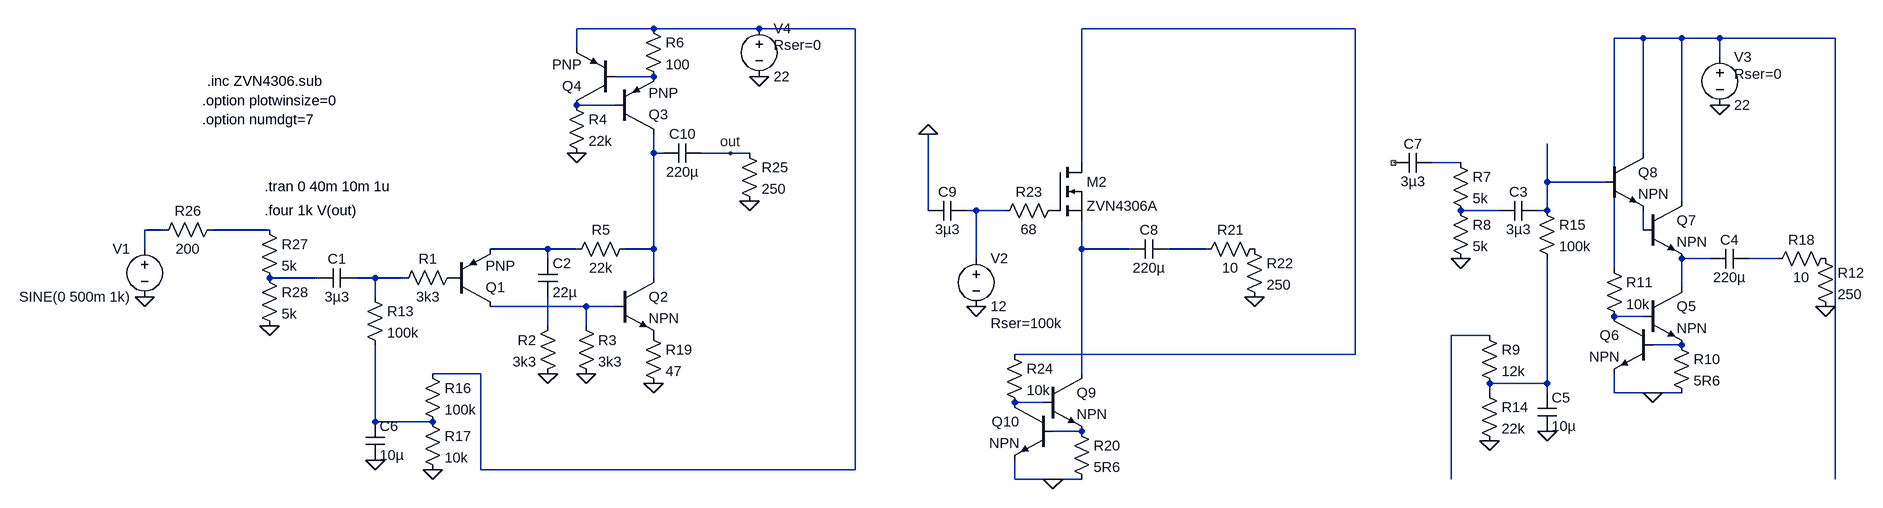
[diagram p0: schematic new_amplifier.asc]
new_amplifier.asc, the LTspice schematic file:
Version 4
SHEET 1 3012 680
WIRE 464 -336 336 -336
WIRE 640 -336 464 -336
WIRE 800 -336 640 -336
WIRE 2160 -336 1616 -336
WIRE 2640 -320 2592 -320
WIRE 2704 -320 2640 -320
WIRE 2768 -320 2704 -320
WIRE 2960 -320 2768 -320
WIRE 336 -304 336 -336
WIRE 2768 -288 2768 -320
WIRE 464 -256 400 -256
WIRE 400 -208 336 -208
WIRE 464 -128 464 -160
WIRE 480 -128 464 -128
WIRE 592 -128 544 -128
WIRE 624 -128 592 -128
WIRE 2640 -128 2640 -320
WIRE 1616 -112 1616 -336
WIRE 2336 -112 2288 -112
WIRE 2480 -80 2480 -144
WIRE 2576 -80 2480 -80
WIRE 2704 -48 2704 -320
WIRE 1360 -32 1360 -160
WIRE 1440 -32 1424 -32
WIRE 1488 -32 1440 -32
WIRE 2400 -32 2336 -32
WIRE 2480 -32 2480 -80
WIRE 2480 -32 2464 -32
WIRE -352 0 -384 0
WIRE -176 0 -272 0
WIRE 2640 0 2640 -32
WIRE -384 32 -384 0
WIRE 288 32 192 32
WIRE 336 32 288 32
WIRE 464 32 464 -128
WIRE 464 32 416 32
WIRE 1616 32 1616 -16
WIRE 1696 32 1616 32
WIRE 1824 32 1760 32
WIRE 288 48 288 32
WIRE 1440 48 1440 -32
WIRE 2752 48 2704 48
WIRE 2864 48 2816 48
WIRE 2592 64 2592 -320
WIRE -96 80 -176 80
WIRE 0 80 -32 80
WIRE 48 80 0 80
WIRE 464 80 464 32
WIRE 2704 96 2704 48
WIRE 0 112 0 80
WIRE 352 128 192 128
WIRE 400 128 352 128
WIRE 2640 144 2592 144
WIRE 288 160 288 112
WIRE 352 160 352 128
WIRE 2384 176 2320 176
WIRE 2704 192 2656 192
WIRE 2160 208 2160 -336
WIRE 2160 208 1504 208
WIRE 176 240 96 240
WIRE 1616 240 1616 32
WIRE 2480 256 2480 48
WIRE 2480 256 2384 256
WIRE 2384 272 2384 256
WIRE 2480 272 2480 256
WIRE 2592 272 2592 240
WIRE 2656 272 2592 272
WIRE 2704 272 2656 272
WIRE 1552 288 1504 288
WIRE 0 320 0 192
WIRE 96 320 0 320
WIRE 1616 336 1568 336
WIRE 176 400 176 240
WIRE 800 400 800 -336
WIRE 800 400 176 400
WIRE 1504 416 1504 384
WIRE 1568 416 1504 416
WIRE 1616 416 1568 416
WIRE 2320 416 2320 176
WIRE 2960 416 2960 -320
FLAG -384 112 0
FLAG 288 240 0
FLAG 352 240 0
FLAG 336 -128 0
FLAG 2336 48 0
FLAG 2656 272 0
FLAG 2768 -208 0
FLAG 2384 352 0
FLAG 0 384 0
FLAG 96 400 0
FLAG 2944 128 0
FLAG 2480 336 0
FLAG 464 256 0
FLAG 1904 112 0
FLAG 1440 128 0
FLAG 1568 416 0
FLAG 1360 -160 0
FLAG 624 -48 0
FLAG 592 -128 out
FLAG -176 160 0
FLAG 640 -256 0
SYMBOL voltage -384 16 M0
WINDOW 123 0 0 Left 0
WINDOW 39 0 0 Left 0
SYMATTR InstName V1
SYMATTR Value SINE(0 500m 1k)
SYMBOL cap -32 64 R90
WINDOW 0 0 32 VBottom 2
WINDOW 3 32 32 VTop 2
SYMATTR InstName C1
SYMATTR Value 3µ3
SYMBOL res 144 64 R90
WINDOW 0 0 56 VBottom 2
WINDOW 3 32 56 VTop 2
SYMATTR InstName R1
SYMATTR Value 3k3
SYMBOL pnp 128 128 M180
SYMATTR InstName Q1
SYMBOL cap 272 48 R0
SYMATTR InstName C2
SYMATTR Value 22µ
SYMBOL res 304 144 M0
SYMATTR InstName R2
SYMATTR Value 3k3
SYMBOL res 336 144 R0
SYMATTR InstName R3
SYMATTR Value 3k3
SYMBOL npn 400 80 R0
SYMATTR InstName Q2
SYMBOL pnp 400 -160 M180
SYMATTR InstName Q3
SYMBOL pnp 400 -208 R180
SYMATTR InstName Q4
SYMBOL res 320 -224 R0
SYMATTR InstName R4
SYMATTR Value 22k
SYMBOL res 432 16 R90
WINDOW 0 0 56 VBottom 2
WINDOW 3 32 56 VTop 2
SYMATTR InstName R5
SYMATTR Value 22k
SYMBOL res 448 -352 R0
SYMATTR InstName R6
SYMATTR Value 100
SYMBOL res 2320 -128 R0
SYMATTR InstName R7
SYMATTR Value 5k
SYMBOL res 2320 -48 R0
SYMATTR InstName R8
SYMATTR Value 5k
SYMBOL cap 2464 -48 R90
WINDOW 0 0 32 VBottom 2
WINDOW 3 32 32 VTop 2
SYMATTR InstName C3
SYMATTR Value 3µ3
SYMBOL npn 2640 96 R0
SYMATTR InstName Q5
SYMBOL npn 2656 144 M0
SYMATTR InstName Q6
SYMBOL res 2688 176 R0
SYMATTR InstName R10
SYMATTR Value 5R6
SYMBOL res 2576 48 R0
SYMATTR InstName R11
SYMATTR Value 10k
SYMBOL cap 2816 32 R90
WINDOW 0 0 32 VBottom 2
WINDOW 3 32 32 VTop 2
SYMATTR InstName C4
SYMATTR Value 220µ
SYMBOL res 2928 32 R0
SYMATTR InstName R12
SYMATTR Value 250
SYMBOL voltage 2768 -304 R0
WINDOW 123 0 0 Left 0
WINDOW 39 24 44 Left 2
SYMATTR SpiceLine Rser=0
SYMATTR InstName V3
SYMATTR Value 22
SYMBOL res -16 96 R0
SYMATTR InstName R13
SYMATTR Value 100k
SYMBOL res 2368 160 R0
SYMATTR InstName R9
SYMATTR Value 12k
SYMBOL res 2464 -48 R0
SYMATTR InstName R15
SYMATTR Value 100k
SYMBOL cap 2464 272 R0
SYMATTR InstName C5
SYMATTR Value 10µ
SYMBOL npn 2576 -128 R0
SYMATTR InstName Q8
SYMBOL res 2368 256 R0
SYMATTR InstName R14
SYMATTR Value 22k
SYMBOL res 80 224 R0
SYMATTR InstName R16
SYMATTR Value 100k
SYMBOL res 80 304 R0
SYMATTR InstName R17
SYMATTR Value 10k
SYMBOL cap -16 320 R0
SYMATTR InstName C6
SYMATTR Value 10µ
SYMBOL res 2960 32 R90
WINDOW 0 0 56 VBottom 2
WINDOW 3 32 56 VTop 2
SYMATTR InstName R18
SYMATTR Value 10
SYMBOL res 448 160 R0
SYMATTR InstName R19
SYMATTR Value 47
SYMBOL npn 2640 -48 R0
SYMATTR InstName Q7
SYMBOL cap 2288 -128 R90
WINDOW 0 0 32 VBottom 2
WINDOW 3 32 32 VTop 2
SYMATTR InstName C7
SYMATTR Value 3µ3
SYMBOL res 1920 16 R90
WINDOW 0 0 56 VBottom 2
WINDOW 3 32 56 VTop 2
SYMATTR InstName R21
SYMATTR Value 10
SYMBOL res 1888 16 R0
SYMATTR InstName R22
SYMATTR Value 250
SYMBOL cap 1760 16 R90
WINDOW 0 0 32 VBottom 2
WINDOW 3 32 32 VTop 2
SYMATTR InstName C8
SYMATTR Value 220µ
SYMBOL res 1584 -48 R90
WINDOW 0 0 56 VBottom 2
WINDOW 3 32 56 VTop 2
SYMATTR InstName R23
SYMATTR Value 68
SYMBOL nmos 1568 -112 R0
SYMATTR InstName M2
SYMATTR Value ZVN4306A
SYMATTR Prefix X
SYMATTR SpiceModel ZVN4306A
SYMBOL cap 1424 -48 R90
WINDOW 0 0 32 VBottom 2
WINDOW 3 32 32 VTop 2
SYMATTR InstName C9
SYMATTR Value 3µ3
SYMBOL voltage 1440 32 R0
WINDOW 123 0 0 Left 0
WINDOW 39 24 124 Left 2
SYMATTR SpiceLine Rser=100k
SYMATTR InstName V2
SYMATTR Value 12
SYMBOL npn 1552 240 R0
SYMATTR InstName Q9
SYMBOL npn 1568 288 M0
SYMATTR InstName Q10
SYMBOL res 1600 320 R0
SYMATTR InstName R20
SYMATTR Value 5R6
SYMBOL res 1488 192 R0
SYMATTR InstName R24
SYMATTR Value 10k
SYMBOL res 608 -144 R0
SYMATTR InstName R25
SYMATTR Value 250
SYMBOL cap 544 -144 R90
WINDOW 0 0 32 VBottom 2
WINDOW 3 32 32 VTop 2
SYMATTR InstName C10
SYMATTR Value 220µ
SYMBOL res -256 -16 R90
WINDOW 0 0 56 VBottom 2
WINDOW 3 32 56 VTop 2
SYMATTR InstName R26
SYMATTR Value 200
SYMBOL res -192 -16 R0
SYMATTR InstName R27
SYMATTR Value 5k
SYMBOL res -192 64 R0
SYMATTR InstName R28
SYMATTR Value 5k
SYMBOL voltage 640 -352 R0
WINDOW 123 0 0 Left 0
WINDOW 39 24 44 Left 2
SYMATTR SpiceLine Rser=0
SYMATTR InstName V4
SYMATTR Value 22
TEXT -184 -72 Left 2 !.tran 0 40m 10m 1u
TEXT -184 -32 Left 2 !.four 1k V(out)
TEXT -288 -216 Left 2 !.option plotwinsize=0
TEXT -288 -184 Left 2 !.option numdgt=7
TEXT -280 -248 Left 2 !.inc ZVN4306.sub

The netlist it stands for:
* new_amplifier.asc
V1 N011 0 SINE(0 500m 1k)
C1 N020 N019 3µ3
R1 P001 N020 3k3
Q1 N021 P001 N014 0 PNP
C2 N014 N023 22µ
R2 N023 0 3k3
R3 N021 0 3k3
Q2 N006 N021 P002 0 NPN
Q3 N006 N005 N004 0 PNP
Q4 N005 N004 N001 0 PNP
R4 N005 0 22k
R5 N006 N014 22k
R6 N001 N004 100
R7 N007 N010 5k
R8 N010 0 5k
C3 N008 N010 3µ3
Q5 N017 N022 N025 0 NPN
Q6 N022 N025 0 0 NPN
R10 N025 0 5R6
R11 N003 N022 10k
C4 N018 N017 220µ
R12 P003 0 250
V3 N003 0 22 Rser=0
R13 N020 N028 100k
R9 N024 N026 12k
R15 N008 N026 100k
C5 N026 0 10µ
Q8 N003 N008 N013 0 NPN
R14 N026 0 22k
R16 N001 N028 100k
R17 N028 0 10k
C6 N028 0 10µ
R18 P003 N018 10
R19 P002 0 47
Q7 N003 N013 N017 0 NPN
C7 N007 NC_01 3µ3
R21 P004 N016 10
R22 P004 0 250
C8 N016 N015 220µ
R23 P005 N009 68
XM2 N002 P005 N015 ZVN4306A ZVN4306A  ; pins D G S
C9 N009 0 3µ3
V2 N009 0 12 Rser=100k
Q9 N015 N027 N029 0 NPN
Q10 N027 N029 0 0 NPN
R20 N029 0 5R6
R24 N002 N027 10k
R25 out 0 250
C10 out N006 220µ
R26 N012 N011 200
R27 N012 N019 5k
R28 N019 0 5k
V4 N001 0 22 Rser=0
.model NPN NPN
.model PNP PNP
.lib standard.bjt
.tran 0 40m 10m 1u
.four 1k V(out)
.option plotwinsize=0
.option numdgt=7
.inc ZVN4306.sub
.backanno
.end